# Altium schematic sheet [01] Cover Page.SchDoc: Cover Page
size A4; Organization: Blinkinlabs, LLC; DocumentNumber: 1; SheetNumber: 1; SheetTotal: 7
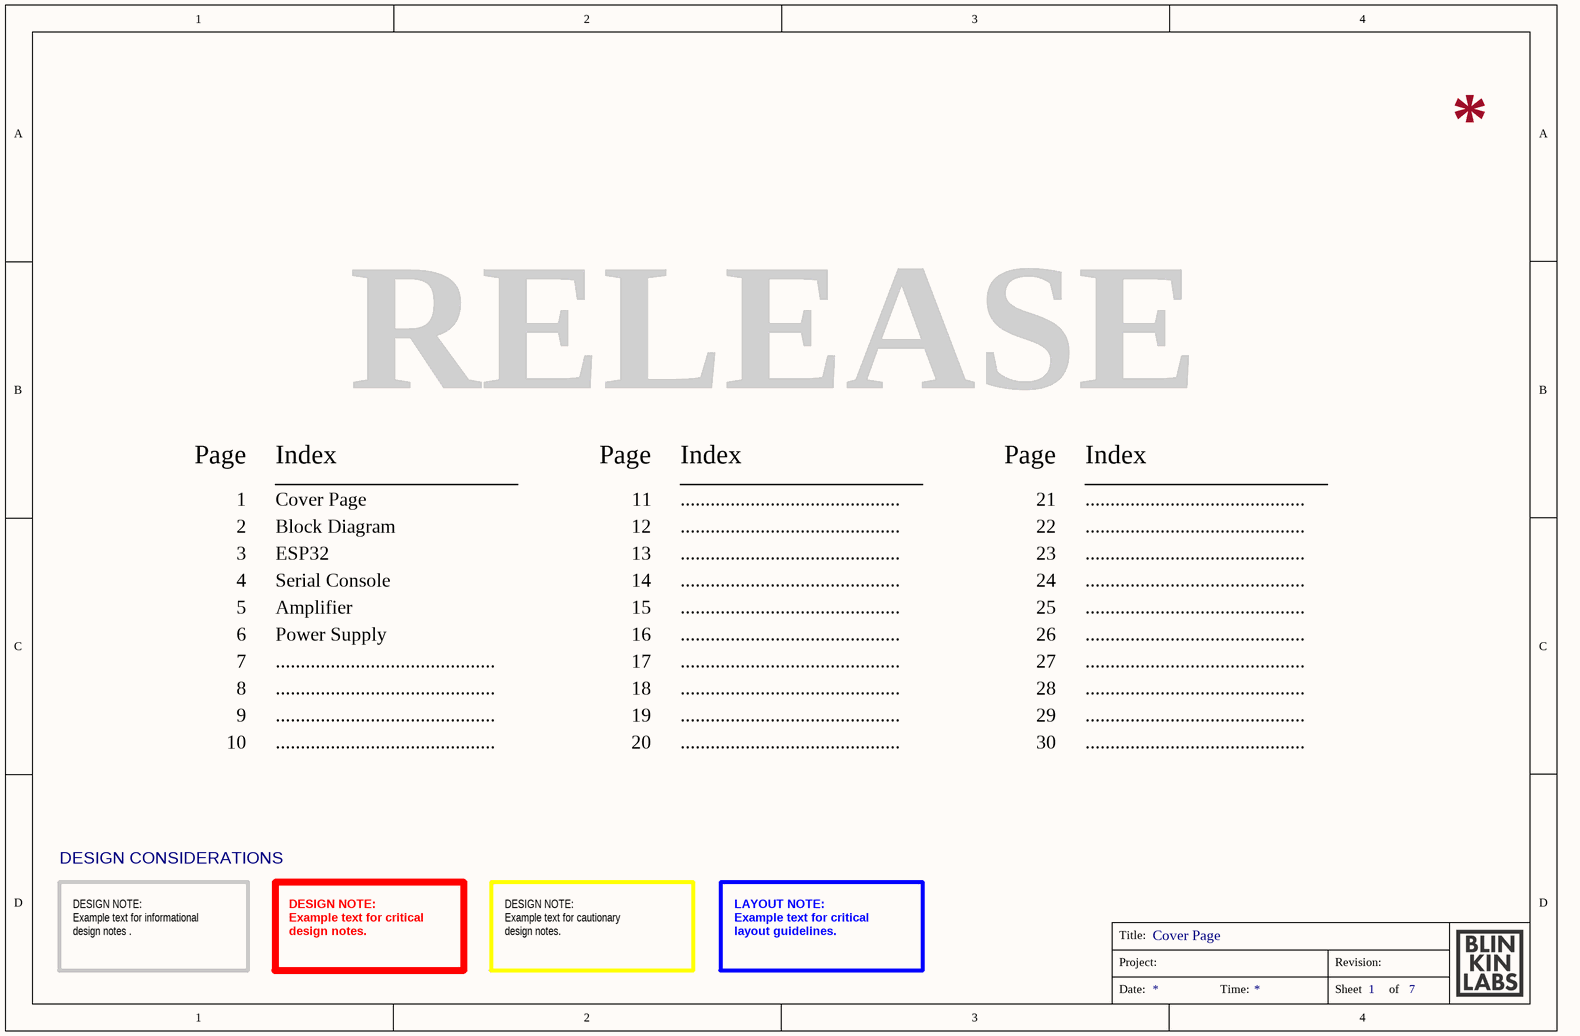
[diagram p0: [01] Cover Page.SchDoc]

## Notes on the sheet
- RELEASE
- Page
- 1
- Index
- Cover Page
- 11
- ............................................
- 21
- 2
- 3
- Block Diagram
- ESP32
- 12
- 13
- 22
- 23
- 4
- 5
- 6
- Serial Console
- Amplifier
- Power Supply
- 14
- 15
- 16
- 24
- 25
- 26
- 7
- 8
- 17
- 18
- 27
- 28
- 9
- 10
- 19
- 20
- 29
- 30
- DESIGN CONSIDERATIONS
- DESIGN NOTE:
  Example text for informational
  design notes .
- DESIGN NOTE:
  Example text for critical
  design notes.
- DESIGN NOTE:
  Example text for cautionary
  design notes.
- LAYOUT NOTE:
  Example text for critical
  layout guidelines.
- Title:
- Project:
- Revision:
- Date:
- Time:
- Sheet
- of